# Altium schematic sheet ipg_wearable.SchDoc
size 254 x 215 mm; CompanyName: University of Maryland; Organization: Shah Lab; SheetNumber: 1; SheetTotal: 4
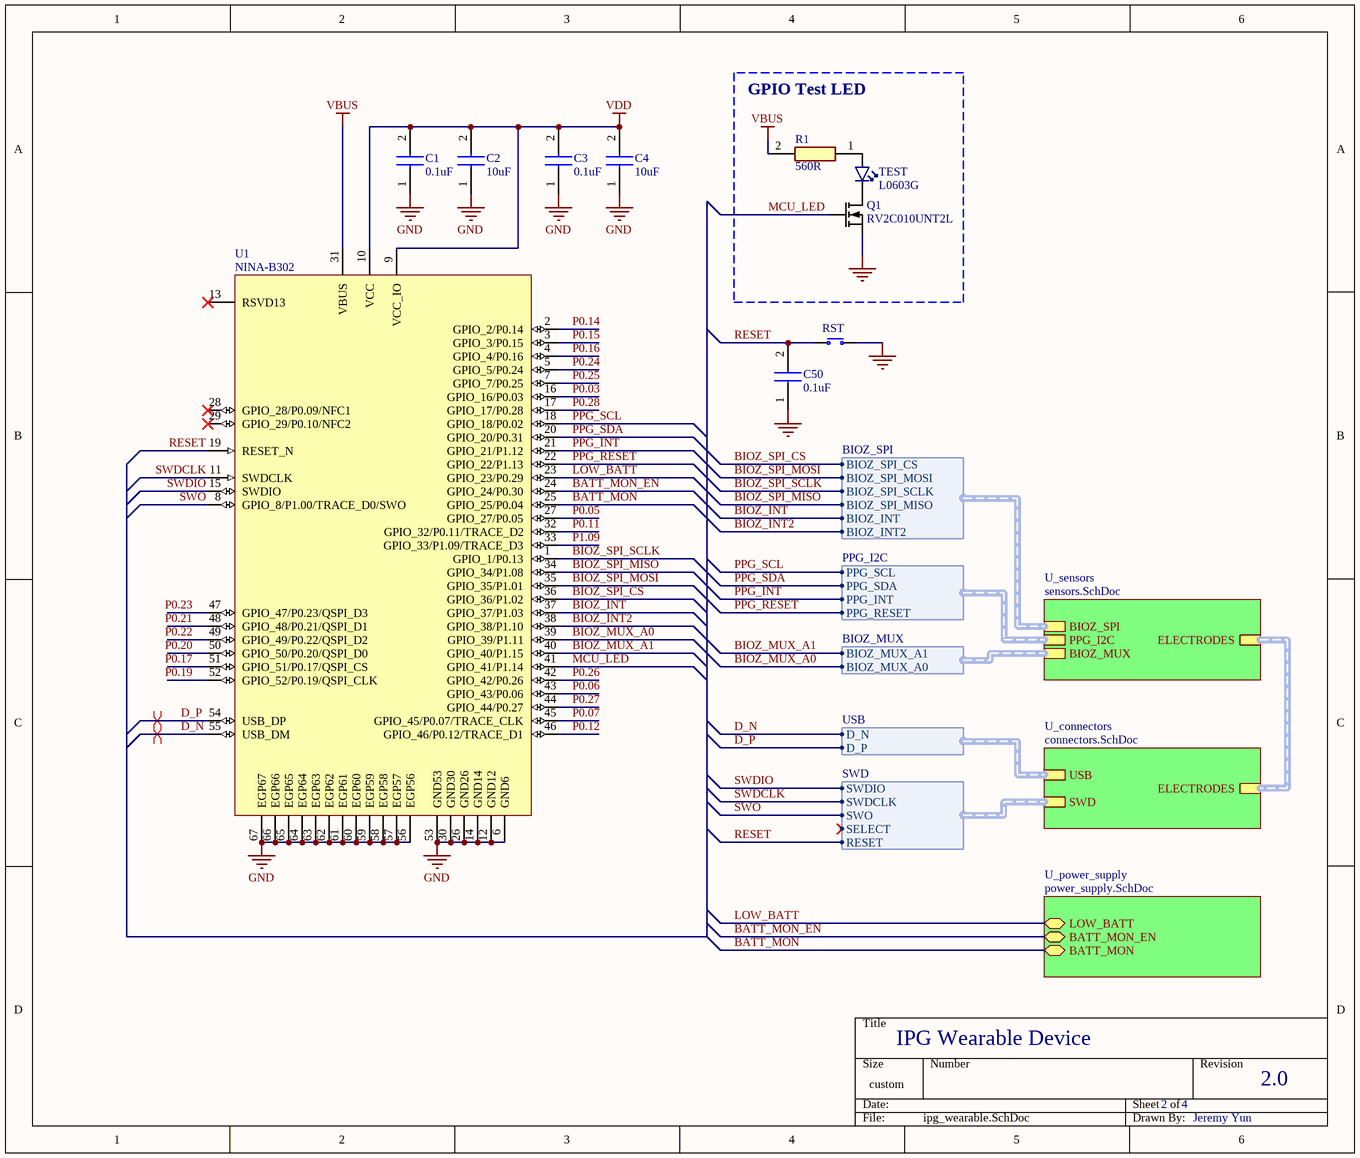
[diagram p0: ipg_wearable.SchDoc]

## Parts
C1  0.1uF  [CAPC1005X55N]
C2  10uF  [CAPC1005X55N]
C3  0.1uF  [CAPC1005X55N]
C4  10uF  [CAPC1005X55N]
C50  0.1uF  [CAPC1005X55N]
Q1  RV2C010UNT2L  [DFN65P100X40-3L]
R1  560R  [RESC1005X40N]
RST  TL1017AABF160QG  [TL1017AABF160QG]  (value not drawn)
TEST  L0603G  [LED_0603_G]
U1  NINA-B302  [NINA_LGA67R_1500X1000X338_PIFA]

## Blocks framed on the sheet
GPIO Test LED: Q1 R1 TEST

## Sub-sheets
U_connectors = connectors.SchDoc: SWD (harness SWD), USB (harness USB), ELECTRODES (harness Electrodes)
U_power_supply = power_supply.SchDoc: LOW_BATT (bidir), BATT_MON_EN (bidir), BATT_MON (bidir)
U_sensors = sensors.SchDoc: ELECTRODES (harness Electrodes), BIOZ_SPI (harness BIOZ_SPI), PPG_I2C (harness PPG_I2C), BIOZ_MUX (harness BIOZ_MUX)

## Harnesses
SWD: SWDIO, SWDCLK, SWO, RESET, SELECT
BIOZ_SPI: BIOZ_SPI_CS, BIOZ_SPI_MOSI, BIOZ_SPI_MISO, BIOZ_SPI_SCLK, BIOZ_INT, BIOZ_INT2
PPG_I2C: PPG_SCL, PPG_SDA, PPG_INT, PPG_RESET
USB: D_P, D_N
BIOZ_MUX: BIOZ_MUX_A0, BIOZ_MUX_A1

## Nets
GND: C1.1 C2.1 C3.1 C4.1 C50.1 Q1.2(S) RST.1(N.O) U1.6(GND6) U1.12(GND12) U1.14(GND14) U1.26(GND26) U1.30(GND30) U1.53(GND53) U1.56(EGP56) U1.57(EGP57) U1.58(EGP58) U1.59(EGP59) U1.60(EGP60) U1.61(EGP61) U1.62(EGP62) U1.63(EGP63) U1.64(EGP64) U1.65(EGP65) U1.66(EGP66) U1.67(EGP67)
VBUS: R1.2 U1.31(VBUS)
VDD: C1.2 C2.2 C3.2 C4.2 U1.9(VCC_IO) U1.10(VCC)
BATT_MON: U1.25(GPIO_25/P0.04) ; sheet U_power_supply/BATT_MON
BATT_MON_EN: U1.24(GPIO_24/P0.30) ; sheet U_power_supply/BATT_MON_EN
BIOZ_INT: U1.37(GPIO_37/P1.03) ; sheet U_sensors/BIOZ_SPI.BIOZ_INT
BIOZ_INT2: U1.38(GPIO_38/P1.10) ; sheet U_sensors/BIOZ_SPI.BIOZ_INT2
BIOZ_MUX_A0: U1.39(GPIO_39/P1.11) ; sheet U_sensors/BIOZ_MUX.BIOZ_MUX_A0
BIOZ_MUX_A1: U1.40(GPIO_40/P1.15) ; sheet U_sensors/BIOZ_MUX.BIOZ_MUX_A1
BIOZ_SPI_CS: U1.36(GPIO_36/P1.02) ; sheet U_sensors/BIOZ_SPI.BIOZ_SPI_CS
BIOZ_SPI_MISO: U1.34(GPIO_34/P1.08) ; sheet U_sensors/BIOZ_SPI.BIOZ_SPI_MISO
BIOZ_SPI_MOSI: U1.35(GPIO_35/P1.01) ; sheet U_sensors/BIOZ_SPI.BIOZ_SPI_MOSI
BIOZ_SPI_SCLK: U1.1(GPIO_1/P0.13) ; sheet U_sensors/BIOZ_SPI.BIOZ_SPI_SCLK
D_N: U1.55(USB_DM) ; sheet U_connectors/USB.D_N
D_P: U1.54(USB_DP) ; sheet U_connectors/USB.D_P
LOW_BATT: U1.23(GPIO_23/P0.29) ; sheet U_power_supply/LOW_BATT
MCU_LED: Q1.1(G) U1.41(GPIO_41/P1.14)
P0.03: U1.16(GPIO_16/P0.03)
P0.05: U1.27(GPIO_27/P0.05)
P0.06: U1.43(GPIO_43/P0.06)
P0.07: U1.45(GPIO_45/P0.07/TRACE_CLK)
P0.11: U1.32(GPIO_32/P0.11/TRACE_D2)
P0.12: U1.46(GPIO_46/P0.12/TRACE_D1)
P0.14: U1.2(GPIO_2/P0.14)
P0.15: U1.3(GPIO_3/P0.15)
P0.16: U1.4(GPIO_4/P0.16)
P0.17: U1.51(GPIO_51/P0.17/QSPI_CS)
P0.19: U1.52(GPIO_52/P0.19/QSPI_CLK)
P0.20: U1.50(GPIO_50/P0.20/QSPI_D0)
P0.21: U1.48(GPIO_48/P0.21/QSPI_D1)
P0.22: U1.49(GPIO_49/P0.22/QSPI_D2)
P0.23: U1.47(GPIO_47/P0.23/QSPI_D3)
P0.24: U1.5(GPIO_5/P0.24)
P0.25: U1.7(GPIO_7/P0.25)
P0.26: U1.42(GPIO_42/P0.26)
P0.27: U1.44(GPIO_44/P0.27)
P0.28: U1.17(GPIO_17/P0.28)
P1.09: U1.33(GPIO_33/P1.09/TRACE_D3)
PPG_INT: U1.21(GPIO_21/P1.12) ; sheet U_sensors/PPG_I2C.PPG_INT
PPG_RESET: U1.22(GPIO_22/P1.13) ; sheet U_sensors/PPG_I2C.PPG_RESET
PPG_SCL: U1.18(GPIO_18/P0.02) ; sheet U_sensors/PPG_I2C.PPG_SCL
PPG_SDA: U1.20(GPIO_20/P0.31) ; sheet U_sensors/PPG_I2C.PPG_SDA
RESET: C50.2 RST.2(COM) U1.19(RESET_N) ; sheet U_connectors/SWD.RESET
SWDCLK: U1.11(SWDCLK) ; sheet U_connectors/SWD.SWDCLK
SWDIO: U1.15(SWDIO) ; sheet U_connectors/SWD.SWDIO
SWO: U1.8(GPIO_8/P1.00/TRACE_D0/SWO) ; sheet U_connectors/SWD.SWO
NetQ1_3: Q1.3(D) TEST.1(C)
NetR1_1: R1.1 TEST.2(A)

Not connected (* = marked no-connect by the designer): U1 13(RSVD13)* 28(GPIO_28/P0.09/NFC1)* 29(GPIO_29/P0.10/NFC2)*

## Buses and harness runs
harness sheet U_connectors/ELECTRODES = sheet U_sensors/ELECTRODES

## Layout directives
differential pair: D_N, D_P

## Notes on the sheet
- IPG Wearable Device
- 2
- 4
- 2.0
- Jeremy Yun

## Library data of the parts
C1 C3 C50 = GRM155R71C104KA88D: Capacitor; Manufacturer_Name: Murata Electronics; Datasheet Link: http://www.murata.com/~/media/webrenewal/support/library/catalog/products/capacitor/mlcc/c02e.pdf; Height: 0.55mm; Manufacturer_Part_Number: GRM155R71C104KA88D; Mouser Part Number: N/A; Arrow Part Number: GRM155R71C104KA88D; Arrow Price/Stock: https://www.arrow.com/en/products/grm155r71c104ka88d/murata-manufacturing?region=nac
C2 C4 = GRM155R60J106ME05D: Capacitor 10uF X5R Ceramic; Manufacturer_Name: Murata Electronics; Datasheet Link: http://www.murata.com/~/media/webrenewal/support/library/catalog/products/capacitor/mlcc/c02e.pdf; Height: 0.55mm; Manufacturer_Part_Number: GRM155R60J106ME05D; Mouser Part Number: 81-GRM155R60J106M05D; Mouser Price/Stock: https://www.mouser.co.uk/ProductDetail/Murata-Electronics/GRM155R60J106ME05D?qs=d0WKAl%252BL4KYEzZPQ8Lkwdw%3D%3D; Arrow Part Number: GRM155R60J106ME05D; Arrow Price/Stock: https://www.arrow.com/en/products/grm155r60j106me05d/murata-manufacturing?region=nac
Q1 = RV2C010UNT2L: N-Channel MOSFET, 20V, 1A, 470mOhm, 400mW; Manufacturer: Rohm Semiconductor; Part number IPS: 00000009976; Note: N.A.; Artikkelnr Noca: 35010020; Pad Count: 3; Part Number: RV2C010UNT2L; Manufacturer Part Number: RV2C010UNT2L; ComponentLink1URL: N.A.; ComponentLink1Description: Datasheet; ComponentLink2URL: N.A.; ComponentLink2Description: Supplier link; HelpURL: http://rohmfs.rohm.com/en/products/databook/datasheet/discrete/transistor/mosfet/rv2c010unt2l-e.pdf; Footprint Doc: DFN-3; LatestRevisionDate: 2016-08-09; Published: 2016-08-09; Value: RV2C010UNT2L; Supplier 1: Digi-Key; Supplier Part Number 1: RV2C010UNT2LCT-ND; Supplier 2: Mouser; Supplier Part Number 2: 755-RV2C010UNT2L; PartId: 101300132; Component Class: Semiconductors; Author: rsk; Part number Norautron: N.A.
R1 = RC0402JR-07560RL: Resistor; Manufacturer_Name: KEMET; Datasheet Link: http://www.yageo.com/documents/recent/PYu-RC0402_51_RoHS_L_6_r.pdf; Height: 0.4mm; Manufacturer_Part_Number: RC0402JR-07560RL; Mouser Part Number: 603-RC0402JR-07560RL; Mouser Price/Stock: https://www.mouser.com/Search/Refine.aspx?Keyword=603-RC0402JR-07560RL
RST = TL1017AABF160QG: Tactile Push Button Switch; Manufacturer_Name: E-Switch; Datasheet Link: https://www.e-switch.com/wp-content/uploads/2023/03/TL1017.pdf; Height: 1.7mm; Manufacturer_Part_Number: TL1017AABF160QG; Mouser Part Number: 612-TL1017AABF160QG; Mouser Price/Stock: https://www.mouser.co.uk/ProductDetail/E-Switch/TL1017AABF160QG?qs=9vOqFld9vZWEDSBQD0ZM5A%3D%3D
TEST = VS 25C7M5: LED, Green, 0603, 573nm, Vf=2.0V, 24mcd, - 40 to +85°C; Manufacturer: Victory Electronics; Part number IPS: 00000001274, 00000009961; Note: N.A.; Artikkelnr Noca: 13019193; Pad Count: 2; Part Number: VS 25C7M5; Manufacturer Part Number: VS 25C7M5; Footprint Doc: 0603; LatestRevisionDate: 2020-10-23; Published: 2017-08-21; Value: L0603G; ComponentLink1URL: N.A.; ComponentLink1Description: Datasheet; ComponentLink2URL: N.A.; ComponentLink2Description: Supplier link; HelpURL: \\hizz\pro\app9717\Datasheet\optoelectronics\Victory Electronics\VS 25C7M5.pdf; Supplier 1: EC Partner; Supplier Part Number 1: N.A.; Supplier 2: N.A.; Supplier Part Number 2: N.A.; PartId: 101400097; Component Class: Optoelectronics; Author: rsk; Part number Norautron: N.A.
U1 = NINA-B302: u-blox NINA-B302 Bluetooth 5 LE, 802.15.4 module; Part Description: Stand-alone Bluetooth low energy module; Manufacturer: u-blox